# Altium schematic sheet 05-Display.SchDoc: Display
size A4; Engineer: Juan M Garin; Organization: ESO; Address1: Juan M Garin; DocumentNumber: 5; Revision: 1.0; SheetNumber: 5; SheetTotal: 6
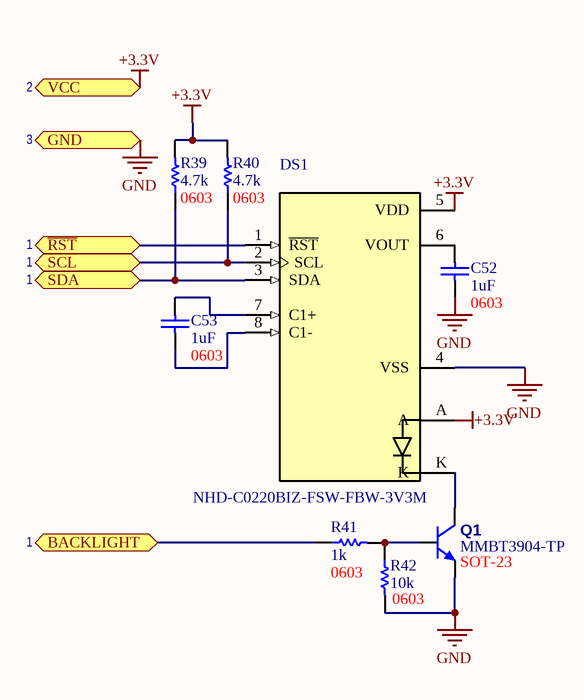
[diagram p0: 05-Display.SchDoc]

## Parts
C52  1uF  PackageReference: 0603  [C0603]
C53  1uF  PackageReference: 0603  [C0603]
DS1  NHD-C0220BIZ-FSW-FBW-3V3M  [NHD-C0220BIZ-FSW-FBW-3V3M]
Q1  MMBT3904-TP  PackageReference: SOT-23  [SOT23-3]
R39  4.7k  PackageReference: 0603  [R0603]
R40  4.7k  PackageReference: 0603  [R0603]
R41  1k  PackageReference: 0603  [R0603]
R42  10k  PackageReference: 0603  [R0603]

## Ports
BACKLIGHT, GND, SCL, SDA, VCC, ~{RST}

## Nets
+3.3V: DS1.5(VDD) DS1.A R39.2 R40.2 ; port VCC
GND: C52.2 DS1.4(VSS) Q1.1(E) R42.2 ; port GND
BACKLIGHT: R41.1 ; port BACKLIGHT
~{RST}: DS1.1(~{RST}) ; port ~{RST}
SCL: DS1.2(SCL) R40.1 ; port SCL
SDA: DS1.3(SDA) R39.1 ; port SDA
NetC52_1: C52.1 DS1.6(VOUT)
NetC53_1: C53.1 DS1.7(C1+)
NetC53_2: C53.2 DS1.8(C1-)
NetDS1_K: DS1.K Q1.3(C)
NetQ1_2: Q1.2(B) R41.2 R42.1

## Notes on the sheet
- 2
- 3
- 1
- Title
- Size:
- Date:
- A4
- Number:
- Time:
- Revision:
- Sheet
- of
- File:

## Library data of the parts
C52 C53 = Cap Semi: Capacitor (Semiconductor SIM Model); Manufacturer Part Number: CL10A105KQ8NNNC; Value: 1uF
DS1 = NHD-C0220BIZ-FSW-FBW-3V3M: n LCD COG CHAR 2X20 WH TRANSFL; Manufacturer Part Number: NHD-C0220BIZ-FSW-FBW-3V3M; Decription: LCD COG CHAR 2X20 WH TRANSFL
Q1 = MMBT3904: TRANS NPN 40V 0.2A SOT-23; Manufacturer Part Number: MMBT3904-TP
R39 R40 = Res1: Resistor; Manufacturer Part Number: RMCF0603JT4K70; Value: 4.7k
R41 = Res1: Resistor; Manufacturer Part Number: RMCF0603FG1K00; Value: 1k
R42 = Res1: Resistor; Manufacturer Part Number: RMCF0603FT10K0; Value: 10k